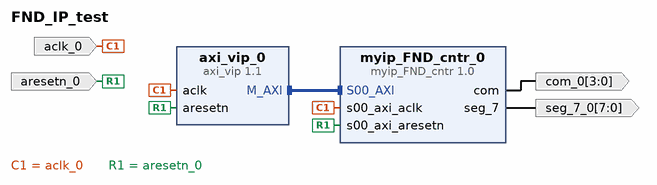
[diagram p0: block diagram of the top level]
# Vivado block design FND_IP_test, xc7a35tcpg236-1, Vivado 2019.2
create_bd_design FND_IP_test

create_bd_port -dir O -from 3 -to 0 com_0
create_bd_port -dir O -from 7 -to 0 seg_7_0
create_bd_port -dir I -type clk aclk_0
create_bd_port -dir I -type rst aresetn_0

create_bd_cell -type ip -vlnv xilinx.com:ip:axi_vip:1.1 axi_vip_0
set_property -dict [list \
  CONFIG.ADDR_WIDTH 32 \
  CONFIG.DATA_WIDTH 32 \
  CONFIG.HAS_BRESP 1 \
  CONFIG.HAS_PROT 1 \
  CONFIG.HAS_RRESP 1 \
  CONFIG.HAS_WSTRB 1 \
  CONFIG.INTERFACE_MODE MASTER \
  CONFIG.PROTOCOL AXI4LITE \
  CONFIG.READ_WRITE_MODE READ_WRITE \
] [get_bd_cells axi_vip_0]
create_bd_cell -type ip -vlnv xilinx.com:user:myip_FND_cntr:1.0 myip_FND_cntr_0

# ---- connections ----

connect_bd_intf_net [get_bd_intf_pins myip_FND_cntr_0/S00_AXI] [get_bd_intf_pins axi_vip_0/M_AXI]
connect_bd_net [get_bd_pins myip_FND_cntr_0/com] [get_bd_ports com_0]
connect_bd_net [get_bd_pins myip_FND_cntr_0/seg_7] [get_bd_ports seg_7_0]
connect_bd_net -net aclk_0_1 [get_bd_ports aclk_0] [get_bd_pins axi_vip_0/aclk] [get_bd_pins myip_FND_cntr_0/s00_axi_aclk]
connect_bd_net -net aresetn_0_1 [get_bd_ports aresetn_0] [get_bd_pins axi_vip_0/aresetn] [get_bd_pins myip_FND_cntr_0/s00_axi_aresetn]

# ---- address map ----
assign_bd_address -offset 0x44A00000 -range 64K -target_address_space [get_bd_addr_spaces axi_vip_0/Master_AXI] [get_bd_addr_segs myip_FND_cntr_0/S00_AXI/S00_AXI_reg]

validate_bd_design
save_bd_design
